# EasyEDA schematic 油泵测控系统电路图.json
TITLE: 油泵测控系统电气原理图; REV: 1.0; Date: 2022-01-08; Sheet: 1/1; Drawn By: 杜慧龙; Company: 合肥工业大学
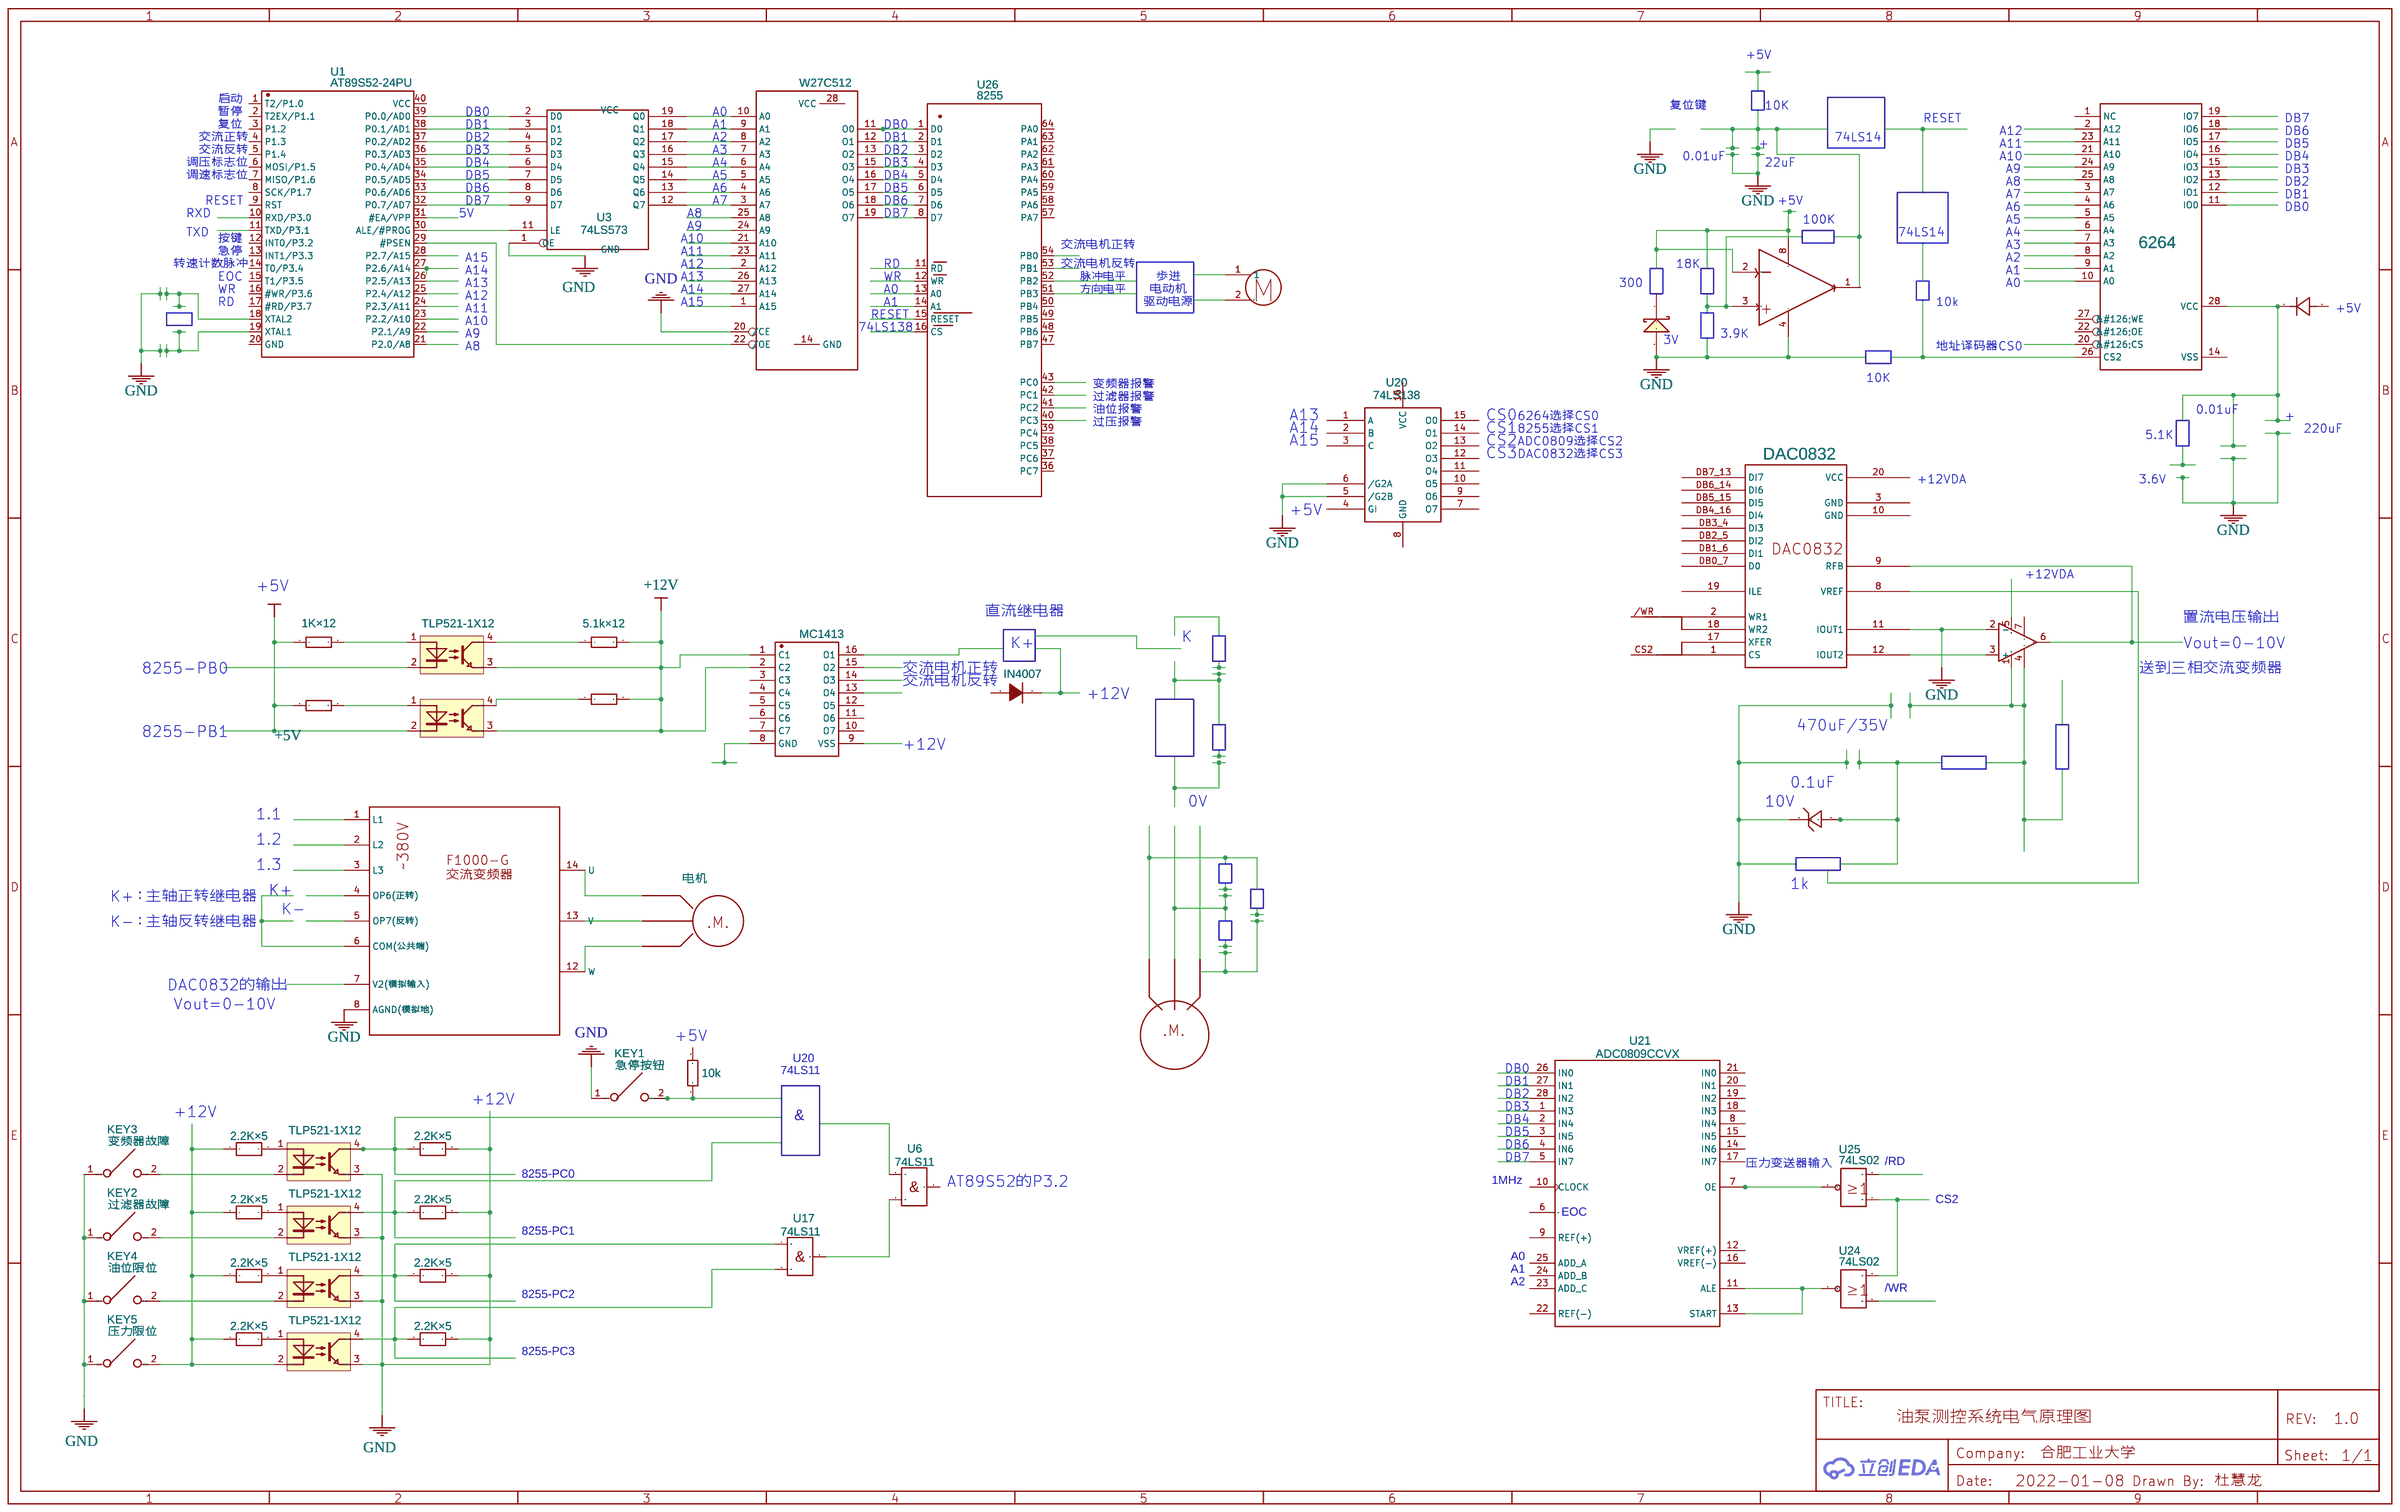
[diagram p0: schematic sheet]

## Parts
D1  ZMM5259B-PEC  [LL-34_L3.5-W1.5-RD]
D2  1N4148WS-T4  [SOD-323_L1.8-W1.3-LS2.5-RD]
KEY1  急停按钮  [8:5H]
KEY2  过滤器故障  [8:5H]
KEY3  变频器故障  [8:5H]
KEY4  油位限位  [8:5H]
KEY5  压力限位  [8:5H]
R1  5.1k×12  [AXIAL-0.4]
R2  1K×12  [0603]
R3  2.2K×5  [R0603]
R4  2.2K×5  [R0603]
R5  2.2K×5  [R0603]
R6  2.2K×5  [R0603]
R7  2.2K×5  [R0603]
R8  2.2K×5  [R0603]
R9  2.2K×5  [R0603]
R10  2.2K×5  [R0603]
R11  1K×12  [0603]
R12  10k  [0603]
R14  1K  [AXIAL-0.4]
U1  AT89S52-24PU  [DIP-40_L52.3-W13.9-P2.54-LS15.2-BL]
U2  DAC0832  [DIP-20]
U3  74LS573
U4  UA741  [UA741_MY]
U5  电机
U6  74LS11
U7  F1000-G 交流变频器
U8  MC1413  [DIP-16_W7.62MM_SOCKET]
U9  TLP521-1X12  [OPTO-SMD-4_L4.6-W6.5-P2.54-LS10.3-TL]
U10  IN4007  [IN4007]
U11  电机
U12  电机
U13  W27C512  [DIP-28_600MIL]
U14  TLP521-1X12  [OPTO-SMD-4_L4.6-W6.5-P2.54-LS10.3-TL]
U15  TLP521-1X12  [OPTO-SMD-4_L4.6-W6.5-P2.54-LS10.3-TL]
U16  TLP521-1X12  [OPTO-SMD-4_L4.6-W6.5-P2.54-LS10.3-TL]
U17  74LS11
U18  TLP521-1X12  [OPTO-SMD-4_L4.6-W6.5-P2.54-LS10.3-TL]
U19  TLP521-1XSM  [OPTO-SMD-4_L4.6-W6.5-P2.54-LS10.3-TL]
U20  74LS138  [SOIC-16_L9.9-W3.9-P1.27-LS6.0-BL]
U21  ADC0809CCVX  [V28A]
U24  74LS02
U25  74LS02
U26  8255
U28  6264  [DIP28-600]
U29  1N4148  [1N4148]
U30  MY-LM393D  [LM393 COPY]  (section 1)

## Library data of the parts
D1 = ZMM5259B-PEC: Supplier: LCSC; Supplier Part: C263374; Manufacturer: PANJIT International; Contributor: LCSC
D2 = 1N4148WS-T4: Supplier: LCSC; Supplier Part: C779738; Manufacturer: ZRE; Contributor: LCSC; JLCPCB Part Class: Extended Part
KEY1-KEY5 = 开关: Supplier Part: C3664; Supplier: LCSC; Manufacturer: ReliaPro; Manufacturer Part: 8:5h Camera switch; image: http://image.lceda.cn/szlcsc/C3664.jpg; Contributor: mega8
R1 R14 = 1K: Power: 1/4W; Tolerance: ±5%; EasyEDA: C61291; Supplier Part: C61291; Supplier: EasyEDA; Manufacturer Part: CFR0W4J0471A50
R2 R11 R12 = 1KΩ(1001)_0603_￥0.007: Supplier: LCSC; Manufacturer: UniOhm; Manufacturer Part: 0603WAF1001T5E; LCSC Assembly: Yes; Supplier Part: C21190
R3-R10 = R_0603_EU: Contributor: LCEDA_Lib
U1 = AT89S52-24PU: Supplier: LCSC; Manufacturer: MICROCHIP; Supplier Part: C9441; JLCPCB Part Class: Extended Part
U2 = DAC0832: Supplier Part: C9752; Supplier: LCSC; Manufacturer: TI; Manufacturer Part: DAC0832LCN; image: //image.lceda.cn/szlcsc/C9752.jpg; Contributor: whisper-7
U3 = 74LS573: Contributor: KiCAD; license: https://www.gnu.org/licenses/lgpl-2.1.html
U4 = UA741
U5 = 电机: Contributor: qq775068
U6 U17 = 与门: Manufacturer Part: New SchematicLib; Contributor: Transistor
U7 = F1000-G 交流变频器: Contributor: William_Herly
U8 = MC1413: Contributor: dicaer
U9 U14-U16 U18 U19 = TLP521-1XSM: Supplier: LCSC; Manufacturer: ISOCOM; image: //image.lceda.cn/szlcsc/C83157.jpg; Supplier Part: C83157; Contributor: ZhangYonghui
U10 = IN4007: Contributor: YTYH
U11 U12 = 电机: Contributor: Sivik1641178563
U13 = W27C512
U20 = 74LS138: Contributor: KiCAD; license: https://www.gnu.org/licenses/lgpl-2.1.html
U21 = ADC0809CCVX: 8-bit Microprocessor Compatible AD Converters With 8-Channel Multiplexer, 28-pin PLCC
U24 U25 = 或非门: Manufacturer Part: New SchematicLib; Contributor: Transistor
U26 = 8255: Contributor: 杜邦线丶小战士
U28 = HM6264LP-10简单排列: Contributor: FourGg
U29 = 1N4148: Contributor: zhengmin222
U30 = MY-LM393D: Contributor: D33ss; subpart_no: 1

## Nets
+5V: R2.1 R11.1 U19.2(LED Cathode)
+12V: R1.2 R14.2 U8.1(C1) U8.2(C2) U18.3(Emitter) U19.3(Emitter)
GND: D1.1(C) KEY1.1 KEY2.1 KEY3.1 KEY4.1 KEY5.1 R7.2 R8.2 R9.2 R10.2 U2.11(IOUT1) U3.1(OE) U4.2(-) U7.8(AGND(模拟地)) U9.3(Emitter) U13.20(/CE) U14.3(Emitter) U15.3(Emitter) U16.3(Emitter) U20.5(/G2B) U20.6(/G2A) U29.2(K) U30.4
Net-(D2-1): D2.1(C) U28.28(VCC)
Net-(KEY1-2): KEY1.2 R12.1
Net-(KEY2-2): KEY2.2 U14.2(LED Cathode)
Net-(KEY3-2): KEY3.2 U9.2(LED Cathode)
Net-(KEY4-2): KEY4.2 U15.2(LED Cathode)
Net-(KEY5-2): KEY5.2 R3.1 R4.1 R5.1 R6.1 U16.2(LED Cathode)
Net-(R1-1): R1.1 U18.4(Collector)
Net-(R2-2): R2.2 U18.1(LED Anode)
Net-(R3-2): R3.2 U9.1(LED Anode)
Net-(R4-2): R4.2 U15.1(LED Anode)
Net-(R5-2): R5.2 U16.1(LED Anode)
Net-(R6-2): R6.2 U14.1(LED Anode)
Net-(R7-1): R7.1 U9.4(Collector)
Net-(R8-1): R8.1 U14.4(Collector)
Net-(R9-1): R9.1 U15.4(Collector) U17.1(PIN1)
Net-(R10-1): R10.1 U16.4(Collector) U17.2(PIN2)
Net-(R11-2): R11.2 U19.1(LED Anode)
Net-(R14-1): R14.1 U19.4(Collector)
Net-(U1-29): U1.29(#PSEN) U13.22(/OE)
Net-(U1-30): U1.30(ALE/#PROG) U3.11(LE)
Net-(U1-32): U1.32(P0.7/AD7) U3.9(D7)
Net-(U1-33): U1.33(P0.6/AD6) U3.8(D6)
Net-(U1-34): U1.34(P0.5/AD5) U3.7(D5)
Net-(U1-35): U1.35(P0.4/AD4) U3.6(D4)
Net-(U1-36): U1.36(P0.3/AD3) U3.5(D3)
Net-(U1-37): U1.37(P0.2/AD2) U3.4(D2)
Net-(U1-38): U1.38(P0.1/AD1) U3.3(D1)
Net-(U1-39): U1.39(P0.0/AD0) U3.2(D0)
Net-(U2-9): U2.9(RFB) U4.6(O)
Net-(U2-12): U2.12(IOUT2) U4.3(+)
Net-(U3-12): U3.12(Q7) U13.3(A7)
Net-(U3-13): U3.13(Q6) U13.4(A6)
Net-(U3-14): U3.14(Q5) U13.5(A5)
Net-(U3-15): U3.15(Q4) U13.6(A4)
Net-(U3-16): U3.16(Q3) U13.7(A3)
Net-(U3-17): U3.17(Q2) U13.8(A2)
Net-(U3-18): U3.18(Q1) U13.9(A1)
Net-(U3-19): U3.19(Q0) U13.10(A0)
Net-(U4-1): U4.1(OFN1) U4.4(V-)
Net-(U6-2): U6.2(PIN2) U17.3(PIN3)
Net-(U13-11): U13.11(O0) U26.1(D0)
Net-(U13-12): U13.12(O1) U26.2(D1)
Net-(U13-13): U13.13(O2) U26.3(D2)
Net-(U13-15): U13.15(O3) U26.4(D3)
Net-(U13-16): U13.16(O4) U26.5(D4)
Net-(U13-17): U13.17(O5) U26.6(D5)
Net-(U13-18): U13.18(O6) U26.7(D6)
Net-(U13-19): U13.19(O7) U26.8(D7)
Net-(U21-7): U21.7(OE) U25.3(PIN3)
Net-(U21-11): U21.11(ALE) U21.13(START) U24.3(PIN3)
Net-(U24-2): U24.2(PIN2) U25.1(PIN1)
Net-(U30.1-2): U30.2 U30.8

Not connected (* = marked no-connect by the designer): D1 2(A); D2 2(A); R12 2; U1 1(T2/P1.0) 2(T2EX/P1.1) 3(P1.2) 4(P1.3) 5(P1.4) 6(MOSI/P1.5) 7(MISO/P1.6) 8(SCK/P1.7) 9(RST) 10(RXD/P3.0) 11(TXD/P3.1) 12(INT0/P3.2) 13(INT1/P3.3) 14(T0/P3.4) 15(T1/P3.5) 16(#WR/P3.6) 17(#RD/P3.7) 18(XTAL2) 19(XTAL1) 20(GND) 21(P2.0/A8) 22(P2.1/A9) 23(P2.2/A10) 24(P2.3/A11) 25(P2.4/A12) 26(P2.5/A13) 27(P2.6/A14) 28(P2.7/A15) 31(#EA/VPP) 40(VCC); U2 1(CS) 2(WR1) 3(GND) 8(VREF) 10(GND) 17(XFER) 18(WR2) 19(ILE) 20(VCC) /WR(8) CS2(9) DB0 7(D0) DB1 6(DI1) DB2 5(DI2) DB3 4(DI3) DB4 16(DI4) DB5 15(DI5) DB6 14(DI6) DB7 13(DI7); U3 10(GND) 20(VCC); U4 5(OFN2) 7(V+); U5 1 2; U6 1(PIN1) 3(PIN3); U7 1(L1) 2(L2) 3(L3) 4(OP6(正转)) 5(OP7(反转)) 6(COM(公共端)) 7(V2(模拟输入)) 12(W) 13(V) 14(U); U8 3(C3) 4(C4) 5(C5) 6(C6) 7(C7) 8(GND) 9(VSS) 10(O7) 11(O6) 12(O5) 13(O4) 14(O3) 15(O2) 16(O1); U10 1(A) 2(C); U13 1(A15) 2(A12) 14(GND) 21(A10) 23(A11) 24(A9) 25(A8) 26(A13) 27(A14) 28(VCC); U18 2(LED Cathode); U20 1(A) 2(B) 3(C) 4(GI) 7(O7) 8(GND) 9(O6) 10(O5) 11(O4) 12(O3) 13(O2) 14(O1) 15(O0) 16(VCC); U21 1(IN3) 2(IN4) 3(IN5) 4(IN6) 5(IN7) 6(START) 8(IN4) 9(REF(+)) 10(CLOCK) 12(VREF(+)) 14(IN6) 15(IN5) 16(VREF(-)) 17(IN7) 18(IN3) 19(IN2) 20(IN1) 21(IN0) 22(REF(-)) 23(ADD C) 24(ADD B) 25(ADD A) 26(IN0) 27(IN1) 28(IN2); U24 1(PIN1); U25 2(PIN2); U26 11(RD) 12(WR) 13(A0) 14(A1) 15(RESET) 16(CS) 36(PC7) 37(PC6) 38(PC5) 39(PC4) 40(PC3) 41(PC2) 42(PC1) 43(PC0) 47(PB7) 48(PB6) 49(PB5) 50(PB4) 51(PB3) 52(PB2) 53(PB1) 54(PB0) 57(PA7) 58(PA6) 59(PA5) 60(PA4) 61(PA3) 62(PA2) 63(PA1) 64(PA0); U28 1(NC) 2(A12) 3(A7) 4(A6) 5(A5) 6(A4) 7(A3) 8(A2) 9(A1) 10(A0) 11(IO0) 12(IO1) 13(IO2) 14(VSS) 15(IO3) 16(IO4) 17(IO5) 18(IO6) 19(IO7) 20(&#126;CS) 21(A10) 22(&#126;OE) 23(A11) 24(A9) 25(A8) 26(CS2) 27(&#126;WE); U29 1(A); U30 1 3

## Notes on the sheet
- +5V
- 启动
- 复位键
- 10K
- 复位
- 暂停
- DB0
- DB1
- A0
- A1
- DB0
- RESET
- DB7
- 交流正转
- DB2
- A2
- DB1
- 74LS14
- A12
- DB6
- 交流反转
- DB3
- A3
- DB2
- +
- A11
- DB5
- 调压标志位
- DB4
- A4
- DB3
- 0.01uF
- 22uF
- A10
- A9
- DB3
- DB4
- 调速标志位
- DB5
- A5
- DB4
- A8
- DB2
- DB6
- A6
- DB5
- A7
- DB1
- RXD
- RESET
- 5V
- DB7
- A8
- A7
- DB6
- DB7
- +5V
- A6
- DB0
- A9
- 100K
- A5
- TXD
- 按键
- A10
- 74LS14
- A4
- 急停
- A15
- A11
- 交流电机正转
- A2
- A3
- 转速计数脉冲
- A14
- A12
- RD
- 交流电机反转
- 18K
- A1
- EOC
- WR
- A13
- A13
- A14
- A0
- WR
- 脉冲电平
- 电动机
- 歩进
- 300
- A0
- RD
- A12
- A15
- A1
- 方向电平
- 驱动电源
- 10k
- A11
- RESET
- +5V
- A10
- A9
- 74LS138
- 3.9K
- A8
- 3V
- 地址译码器CS0
- 10K
- 变频器报警
- 过滤器报警
- 油位报警
- 过压报警
- A13
- CS0
- 6264选择CS0
- 0.01uF
- +
- A14
- A15
- CS1
- CS2
- 8255选择CS1
- 5.1K
- 220uF
- CS3
- ADC0809选择CS2
- DAC0832选择CS3
- +12VDA
- 3.6V
- +5V
- +5V
- +12VDA
- 直流继电器
- 置流电压输出
- K+
- K
- Vout=0-10V
- 8255-PB0
- 交流电机正转
- 送到三相交流变频器
- 交流电机反转
- +12V
- 8255-PB1
- 470uF/35V
- +12V
- 0.1uF
- 1.1
- 0V
- 10V
- 1.2
- 1.3
- 1k
- K+：主轴正转继电器
- K+
- K-
- K-：主轴反转继电器
- DAC0832的输出
- Vout=0-10V
- +5V
- U20
- 74LS11
- DB0
- DB1
- DB2
- +12V
- +12V
- DB3
- &
- DB4
- DB5
- DB6
- DB7
- 压力变送器输入
- /RD
- 8255-PC0
- AT89S52的P3.2
- 1MHz
- CS2
- EOC
- 8255-PC1
- A0
- A1
- A2
- /WR
- 8255-PC2
- 8255-PC3
